# EAGLE design SparkFun_Micro_Bit_Moto_Bit (EAGLE 7.7.0)
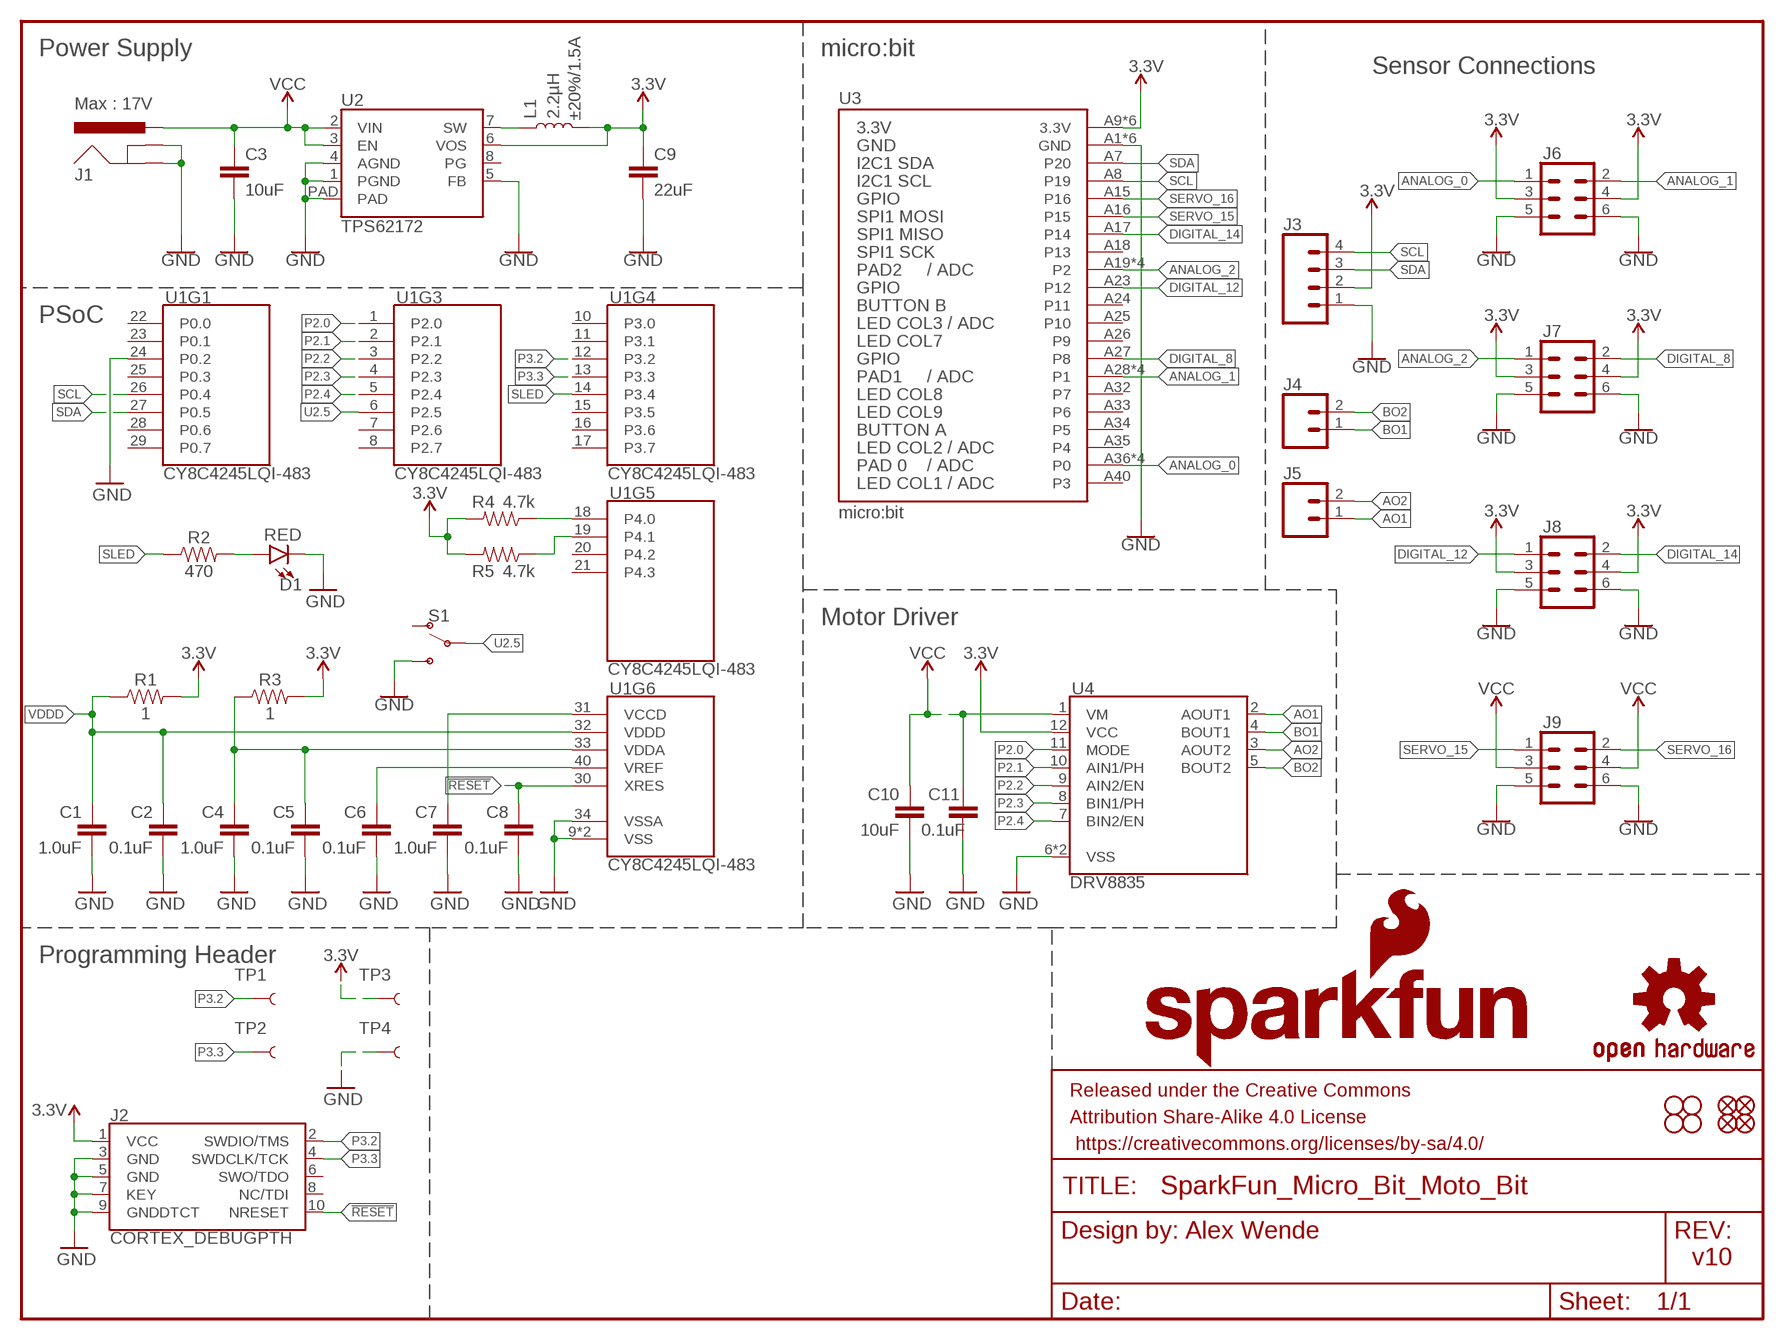
[diagram p0: schematic, sheet 1]

## Parts
C1  1.0uF  1.0UF-0603-16V-10%  [0603]
C2  0.1uF  0.1UF-0603-25V-(+80/-20%)  [0603]
C3  10uF  10UF-1210-50V-20%  [1210]
C4  1.0uF  1.0UF-0603-16V-10%  [0603]
C5  0.1uF  0.1UF-0603-25V-(+80/-20%)  [0603]
C6  0.1uF  0.1UF-0603-25V-(+80/-20%)  [0603]
C7  1.0uF  1.0UF-0603-16V-10%  [0603]
C8  0.1uF  0.1UF-0603-25V-(+80/-20%)  [0603]
C9  22uF  22UF-0805-6.3V-20%  [0805]
C10  10uF  10UF-1210-50V-20%  [1210]
C11  0.1uF  0.1UF-0603-25V-(+80/-20%)  [0603]
D1  RED  LED-RED0603  [LED-0603]
FD1  FIDUCIALUFIDUCIAL  [FIDUCIAL-MICRO]
FD2  FIDUCIALUFIDUCIAL  [FIDUCIAL-MICRO]
FD3  FIDUCIALUFIDUCIAL  [FIDUCIAL-MICRO]
FD4  FIDUCIALUFIDUCIAL  [FIDUCIAL-MICRO]
FRAME1  FRAME-LETTER  [CREATIVE_COMMONS]
H1  STAND-OFF  [STAND-OFF]
H2  STAND-OFF  [STAND-OFF]
H3  STAND-OFF  [STAND-OFF]
H4  STAND-OFF  [STAND-OFF]
J1  POWER_JACKPTH_LOCK  [POWER_JACK_PTH_LOCK]
J2  CORTEX_DEBUGPTH  [2X5-PTH-1.27MM]
J3  CONN_04SMD_STRAIGHT_COMBO  [1X04_SMD_VERTICAL_COMBO]
J4  CONN_02PTH_RA_FEMALE  [1X02_RA_FEMALE]
J5  CONN_02PTH_RA_FEMALE  [1X02_RA_FEMALE]
J6  CONN_03X2SMT  [2X3_SMT_POSTS]
J7  CONN_03X2SMT  [2X3_SMT_POSTS]
J8  CONN_03X2SMT  [2X3_SMT_POSTS]
J9  CONN_03X2SMT  [2X3_SMT_POSTS]
L1  2.2µH  INDUCTOR-VLF4012AT-2.2UH  [INDUCTOR_2.2UH]
LOGO1  SFE_LOGO_NAME_FLAME.3_INCH  [SFE_LOGO_NAME_FLAME_.3]
LOGO2  OSHW-LOGOL  [OSHW-LOGO-L]
R1  1  1OHM-0603-1/10W-1%  [0603]
R2  470  470OHM-0603-1/10W-1%  [0603]
R3  1  1OHM-0603-1/10W-1%  [0603]
R4  4.7k  4.7KOHM-0603-1/10W-1%  [0603]
R5  4.7k  4.7KOHM-0603-1/10W-1%  [0603]
S1  SWITCH-SPDT-PTH-11.6X4.0MM  [SWITCH_SPDT_PTH_11.6X4.0MM]
TP1  TEST-POINT3  [PAD.03X.03]
TP2  TEST-POINT3  [PAD.03X.03]
TP3  TEST-POINT3  [PAD.03X.03]
TP4  TEST-POINT3  [PAD.03X.03]
U1  CY8C4245LQI-483  PSOC4_4200_40QFN  [QFN-40]
U2  TPS62172  [WSON-8-PAD]
U3  micro:bit  MICRO:BITLEDS_UP  [MICRO:BIT_RA_PTH]
U4  DRV8835  DRV883X  [WSON-12]

## Nets
3.3V: C9.1 J2.1(VCC) J3.2 J6.3 J6.4 J7.3 J7.4 J8.3 J8.4 L1.P$2 R1.2 R3.2 R4.2 R5.2 TP3.P$1 U2.6(VOS) U3.A9(3.3V) U3.A10(3.3V) U3.A11(3.3V) U3.A12(3.3V) U3.A13(3.3V) U3.A14(3.3V) U4.12(VCC)
!RESET: C8.1 J2.10(NRESET) U1.30(XRES)
ANALOG_0: J6.1 U3.A36(P0) U3.A37(P0) U3.A38(P0) U3.A39(P0)
ANALOG_1: J6.2 U3.A28(P1) U3.A29(P1) U3.A30(P1) U3.A31(P1)
ANALOG_2: J7.1 U3.A19(P2) U3.A20(P2) U3.A21(P2) U3.A22(P2)
AO1: J5.1 U4.2(AOUT1)
AO2: J5.2 U4.3(AOUT2)
BO1: J4.1 U4.4(BOUT1)
BO2: J4.2 U4.5(BOUT2)
DIGITAL_8: J7.2 U3.A27(P8)
DIGITAL_12: J8.1 U3.A23(P12)
DIGITAL_14: J8.2 U3.A17(P14)
GND: C1.2 C2.2 C3.2 C4.2 C5.2 C6.2 C7.2 C8.2 C9.2 C10.2 C11.2 D1.C J1.GND J1.GNDBREAK J2.3(GND) J2.5(GND) J2.7(KEY) J2.9(GNDDTCT) J3.1 J6.5 J6.6 J7.5 J7.6 J8.5 J8.6 J9.5 J9.6 S1.3(S) TP4.P$1 U1.9(VSS) U1.24(P0.2) U1.34(VSSA) U1.EP(VSS) U2.1(PGND) U2.4(AGND) U2.5(FB) U2.PAD U3.A1(GND) U3.A2(GND) U3.A3(GND) U3.A4(GND) U3.A5(GND) U3.A6(GND) U4.6(VSS) U4.PAD(VSS)
N$1: C7.1 U1.31(VCCD)
N$2: C6.1 U1.40(VREF)
N$3: C4.1 C5.1 R3.1 U1.33(VDDA)
N$4: L1.P$1 U2.7(SW)
N$6: R4.1 U1.18(P4.0)
N$7: R5.1 U1.19(P4.1)
N$8: D1.A R2.2
P2.0: U1.1(P2.0) U4.11(MODE)
P2.1: U1.2(P2.1) U4.10(AIN1/PH)
P2.2: U1.3(P2.2) U4.9(AIN2/EN)
P2.3: U1.4(P2.3) U4.8(BIN1/PH)
P2.4: U1.5(P2.4) U4.7(BIN2/EN)
P3.2: J2.2(SWDIO/TMS) TP1.P$1 U1.12(P3.2)
P3.3: J2.4(SWDCLK/TCK) TP2.P$1 U1.13(P3.3)
SCL: J3.4 U1.26(P0.4) U3.A8(P19)
SDA: J3.3 U1.27(P0.5) U3.A7(P20)
SERVO_15: J9.1 U3.A16(P15)
SERVO_16: J9.2 U3.A15(P16)
SLED: R2.1 U1.14(P3.4)
U2.5: S1.2(P) U1.6(P2.5)
VCC: C3.1 C10.1 C11.1 J1.PWR J9.3 J9.4 U2.2(VIN) U2.3(EN) U4.1(VM)
VDDD: C1.1 C2.1 R1.1 U1.32(VDDD)
Unconnected: J2.6(SWO/TDO) J2.8(NC/TDI) S1.1(O) U1.7(P2.6) U1.8(P2.7) U1.10(P3.0) U1.11(P3.1) U1.15(P3.5) U1.16(P3.6) U1.17(P3.7) U1.20(P4.2) U1.21(P4.3) U1.22(P0.0) U1.23(P0.1) U1.25(P0.3) U1.28(P0.6) U1.29(P0.7) U1.35(P1.0) U1.36(P1.1) U1.37(P1.2) U1.38(P1.3) U1.39(P1.4) U2.8(PG) U3.A18(P13) U3.A24(P11) U3.A25(P10) U3.A26(P9) U3.A32(P7) U3.A33(P6) U3.A34(P5) U3.A35(P4) U3.A40(P3)

## Notes on the sheet
- Power Supply | micro:bit
- Sensor Connections
- Max : 17V
- ±20%/1.5A
- PSoC
- Motor Driver
- Programming Header
- Alex Wende
- v10

## Library data of the parts
C1 C4 C7 = SparkFun-Capacitors:1.0UF: 1µF ceramic capacitors A capacitor is a passive two-terminal electrical component used to store electrical energy temporarily in an electric field.; PROD_ID: CAP-00868
C2 C5 C6 C8 C11 = SparkFun-Capacitors:0.1UF: 0.1µF ceramic capacitors A capacitor is a passive two-terminal electrical component used to store electrical energy temporarily in an electric field.; PROD_ID: CAP-00810
C3 C10 = SparkFun-Capacitors:10UF: 10.0µF ceramic capacitors A capacitor is a passive two-terminal electrical component used to store electrical energy temporarily in an electric field.; PROD_ID: CAP-09824
C9 = SparkFun-Capacitors:22UF: 22µF ceramic capacitors A capacitor is a passive two-terminal electrical component used to store electrical energy temporarily in an electric field.; PROD_ID: CAP-08402
D1 = SparkFun-LED:LED-RED: Red SMD LED Used in manufacturing of most products at SparkFun Packages: 0603 - SMD 0603 package [Product Link] <http://docs.avagotech.com/docs/AV02-0551EN> 0603 SMART - SMD 0603 SMART package ( more efficient and expensive)[Product Link] <http://www.osram-os.com/Graphics/XPic2/00077099_0.pdf> 1206 - SMD1206 package [Product Link] <https://www.sparkfun.com/datasheets/DevTools/LilyPad/Q150OVS4.pdff> SparkFun Products: Pro Mini 328 -5V <https://www.sparkfun.com/products/821> RedBoard <https://www.sparkfun.com/products/12757> IOIO-OTG <https://www.sparkfun.com/products/13613>; PROD_ID: DIO-00819
FD1-FD4 = SparkFun-Aesthetics:FIDUCIAL: Fiducial Alignment Points Point-of-reference for pick-and-place machines and other optical instruments.
FRAME1 = SparkFun-Aesthetics:FRAME-LETTER: Schematic Frame - Letter Standard 8.5x11 US Letter frame
H1-H4 = SparkFun-Hardware:STAND-OFF: Stand Off Drill holes for mechanically mounting via screws, standoffs, etc. Note: Use the keepout ring to avoid running the screw head into surrounding components. Variant Overviews STAND-OFF - Mechanical footprint for a #4 phillips button head screw. STAND-OFF-TIGHT - Mechanical footprint for a #4 phillips button head screw, Example SparkFun Products Screw - Phillips Head (1/4", 4-40, 10 pack) <https://www.sparkfun.com/products/10453> (PRT-10453) Screw - Phillips Head (1/2", 4-40, 10 pack) <https://www.sparkfun.com/products/10452> (PRT-10452) Screw - Phillips Head (3/4", 4-40, 10 pack) <https://www.sparkfun.com/products/10451> (PRT-10451) Screw - Phillips Head (1", 4-40, 10 pack) <https://www.sparkfun.com/products/10450> (PRT-10450)
J1 = SparkFun-Connectors:POWER_JACK: Power Jack Connector This is the standard 5.5mm barrel jack for power. The PTH is the most common, proven, reliable, footprint. The Slot footprint only works if the mill layer is transmitted to the PCB fab house so be warned. Here are the connectors we sell at SparkFun: DC Barrel Power Jack/Connector <https://www.sparkfun.com/products/119> (PRT-00119) DC Barrel Power Jack/Connector (SMD) <https://www.sparkfun.com/products/12748> (PRT-12748) DC Barrel Jack Adapter - Breadboard Compatible <https://www.sparkfun.com/products/10811> (PRT-10811) It is used on this SparkFun product (and many, many others): SparkFun RedBoard - Programmed with Arduino <https://www.sparkfun.com/products/12757> (DEV-12757) Also, if you need a mating power supply or connector, please check these out: Wall Adapter Power Supply - 9VDC 650mA <https://www.sparkfun.com/products/298> (TOL-00298) DC Barrel Jack Adapter - Male <https://www.sparkfun.com/products/10287> (PRT-10287); PROD_ID: CONN-08197; SF_ID: PRT-00119
J2 = Pete_Connectors_Retired:CORTEX_DEBUG: Cortex Debug Connector Datasheet <http://infocenter.arm.com/help/topic/com.arm.doc.faqs/attached/13634/cortex_debug_connectors.pdf>
J3 = SparkFun-Connectors:CONN_04: Multi connection point. Often used as Generic Header-pin footprint for 0.1 inch spaced/style header connections On any of the 0.1 inch spaced packages, you can populate with these: Break Away Headers - Straight <https://www.sparkfun.com/products/116> (PRT-00116) Break Away Male Headers - Right Angle <https://www.sparkfun.com/products/553> (PRT-00553) Female Headers <https://www.sparkfun.com/products/115> (PRT-00115) Break Away Headers - Machine Pin <https://www.sparkfun.com/products/117> (PRT-00117) Break Away Female Headers - Swiss Machine Pin <https://www.sparkfun.com/products/743> (PRT-00743) For SCREWTERMINALS and SPRING TERMINALS visit here: Screw Terimnals on SparkFun.com <https://www.sparkfun.com/search/results?term=Screw+Terminals> (5mm/3.5mm/2.54mm spacing) This device is also useful as a general connection point to wire up your design to another part of your project. Our various solder wires solder well into these plated through hole pads. Hook-Up Wire - Assortment (Stranded, 22 AWG) <https://www.sparkfun.com/products/11375> (PRT-11375) Hook-Up Wire - Assortment (Solid Core, 22 AWG) <https://www.sparkfun.com/products/11367> (PRT-11367) View the entire wire category on our website here <https://www.sparkfun.com/categories/141> Special notes: Molex polarized connector foot print use with SKU : PRT-08231 with associated crimp pins and housings. 1MM SMD Version SKU: PRT-10208; PROD_ID: CONN-08511; VALUE: 1X04_SMD_STRAIGHT_COMBO
J4 J5 = SparkFun-Connectors:CONN_02: Multi connection point. Often used as Generic Header-pin footprint for 0.1 inch spaced/style header connections On any of the 0.1 inch spaced packages, you can populate with these: Break Away Headers - Straight <https://www.sparkfun.com/products/116> (PRT-00116) Break Away Male Headers - Right Angle <https://www.sparkfun.com/products/553> (PRT-00553) Female Headers <https://www.sparkfun.com/products/115> (PRT-00115) Break Away Headers - Machine Pin <https://www.sparkfun.com/products/117> (PRT-00117) Break Away Female Headers - Swiss Machine Pin <https://www.sparkfun.com/products/743> (PRT-00743) For SCREWTERMINALS and SPRING TERMINALS visit here: Screw Terimnals on SparkFun.com <https://www.sparkfun.com/search/results?term=Screw+Terminals> (5mm/3.5mm/2.54mm spacing) This device is also useful as a general connection point to wire up your design to another part of your project. Our various solder wires solder well into these plated through hole pads. Hook-Up Wire - Assortment (Stranded, 22 AWG) <https://www.sparkfun.com/products/11375> (PRT-11375) Hook-Up Wire - Assortment (Solid Core, 22 AWG) <https://www.sparkfun.com/products/11367> (PRT-11367) View the entire wire category on our website here <https://www.sparkfun.com/categories/141> Special notes: Molex polarized connector foot print use with: PRT-08233 with associated crimp pins and housings. 2.54_SCREWTERM for use with PRT-10571. 3.5mm Screw Terminal footprints for PRT-08084 5mm Screw Terminal footprints for use with PRT-08432; PROD_ID: CONN-13700
J6-J9 = SparkFun-Connectors:CONN_03X2: Multi connection point. Often used as Generic Header-pin footprint for 0.1 inch spaced/style header connections You can populate with any combo of single row headers, but if you'd like an exact match, check these: Header - 2x3 (Male, 0.1") <https://www.sparkfun.com/products/12807> (PRT-12807) Header - 2x3 (Female, 0.1") <https://www.sparkfun.com/products/13010> (PRT-13010) 2x3 Pin Shrouded Header <https://www.sparkfun.com/products/10877> (PRT-10877) On any of the 0.1 inch spaced packages, you can populate with these: Break Away Headers - Straight <https://www.sparkfun.com/products/116> (PRT-00116) Break Away Male Headers - Right Angle <https://www.sparkfun.com/products/553> (PRT-00553) Female Headers <https://www.sparkfun.com/products/115> (PRT-00115) Break Away Headers - Machine Pin <https://www.sparkfun.com/products/117> (PRT-00117) Break Away Female Headers - Swiss Machine Pin <https://www.sparkfun.com/products/743> (PRT-00743) Special note: the shrouded connector mates well with our 3x2 ribbon cables: Ribbon Crimp Connector - 6-pin (2x3, Female) <https://www.sparkfun.com/products/10651> (PRT-10651) Ribbon Cable - 6 wire (15ft) <https://www.sparkfun.com/products/10646> (PRT-10646); PROD_ID: CONN-11415
L1 = SparkFun-Coils:INDUCTOR: Inductors Resist changes in electrical current. Basically a coil of wire. SparkFun Products: SparkFun Load Cell Amplifier - HX711 <https://www.sparkfun.com/products/13879> IOIO-OTG - V2.2 <https://www.sparkfun.com/products/13613>; PROD_ID: NDUC-09513; VALUE: 2.2µH/±20%/1.5A
LOGO1 = SparkFun-Aesthetics:SFE_LOGO_NAME_FLAME: SparkFun Font Logo w/ Flame This is the SparkFun full logo. The logo on the schematic will always be the same size; the package variant is the height of the flame part of the logo. Default layer for the logo on the board is tSilk.
LOGO2 = SparkFun-Aesthetics:OSHW-LOGO: Open-Source Hardware (OSHW) Logo This logo indicates the piece of hardware it is found on incorporates a OSHW license and/or adheres to the definition of open source hardware found here: http://freedomdefined.org/OSHW
R1 R3 = SparkFun-Resistors:1OHM: 1Ω resistor A resistor is a passive two-terminal electrical component that implements electrical resistance as a circuit element. Resistors act to reduce current flow, and, at the same time, act to lower voltage levels within circuits. - Wikipedia; PROD_ID: RES-08269
R2 = SparkFun-Resistors:470OHM: 470Ω resistor A resistor is a passive two-terminal electrical component that implements electrical resistance as a circuit element. Resistors act to reduce current flow, and, at the same time, act to lower voltage levels within circuits. - Wikipedia; PROD_ID: RES-07869
R4 R5 = SparkFun-Resistors:4.7KOHM: 4.7kΩ resistor A resistor is a passive two-terminal electrical component that implements electrical resistance as a circuit element. Resistors act to reduce current flow, and, at the same time, act to lower voltage levels within circuits. - Wikipedia; PROD_ID: RES-07857
S1 = SparkFun-Switches:SWITCH-SPDT: Single Pole, Double Throw (SPDT) Switch Single-pole, double-throw (SPDT) switch. Variant Overview SMD-AYZ0202 Surface Mount DPDT Switch <https://www.sparkfun.com/products/597> (COM-00597) Used on e.g. LilyPad Arduino USB - ATmega32U4 Board <https://www.sparkfun.com/products/12049> PTH-11.6X4.0MM SPDT Mini Power Switch <https://www.sparkfun.com/products/102> (COM-00102) Used on e.g. SparkFun Simon Says - Through-Hole Soldering Kit <https://www.sparkfun.com/products/10547> (KIT-10547) PTH-11.6X4.0MM-KIT KIT version of SPDT Mini Power Switch - Simplifies soldering by removing tStop of switch pins - only one side can be soldered. PTH-11.6X4.0MM-LOCK LOCK version of SPDT Mini Power Switch - Offset pins hold switch in place for easier soldering. SMD-RIGHT-ANGLE Surface Mount Right Angle Switch <https://www.sparkfun.com/products/10860> (COM-10860) Used on e.g. SparkFun ESP8266 Thing <https://www.sparkfun.com/products/13231>; PROD_ID: SWCH-08261; SF_SKU: COM-00102
TP1-TP4 = SparkFun-Connectors:TEST-POINT: SparkFun Test Points Bare copper test points for troubleshooting or In-Circuit-Testing. These are used by our Production team for verifying production board runs using pogo-pins on test beds. SparkFun Products: SparkFun LSM9DS1 Breakout <https://www.sparkfun.com/products/13284> SparkFun PSOC <https://www.sparkfun.com/products/13714> SparkFun Load Cell Amplifier <https://www.sparkfun.com/products/13879>
U1 = SparkFun-IC-Microcontroller:PSOC4_4200_40QFN: Cypress PSoC 4200 32-bit MCU 48-MHz ARM Cortex-M0 Datasheet <http://www.cypress.com/file/138656/download> SparkFun Products: SparkFun serial Controlled Motor Driver <https://www.sparkfun.com/products/13911>; PROD_ID: IC-13292
U2 = SparkFun-IC-Power:TPS62172: Texas Instruments TPS62172 3-17V 0.5A Step-Down Converter with DCS control. Available in adjustable and fixed output voltage versions. Is packaged in an 8-pin WSON package measuring 2 × 2 mm (DSG). See a 3.3V fixed output version of this chip in action on the Electric Imp Breakout Board <https://www.sparkfun.com/products/11400>. Datasheet <http://www.ti.com/lit/gpn/tps62172>; PROD_ID: IC-11307
U3 = Micro_Bit_Parts:MICRO:BIT: BBC MICRO_BIT with 5x5 LED array facing the direction noted in the variant. "UP" means away from the host board, "Down" means facing towards the host board.; PROD_ID: CONN-13452
U4 = SparkFun-IC-Special-Function:DRV883X: DRV8835 2 Channel Motor Driver Dual 1.5A H-bridge, 2-11V Datasheet <http://www.ti.com/lit/ds/symlink/drv8835.pdf> SparkFun Products: SparkFun Serial Controlled Motor Driver <https://www.sparkfun.com/products/13911>; PROD_ID: IC-13342

## Board
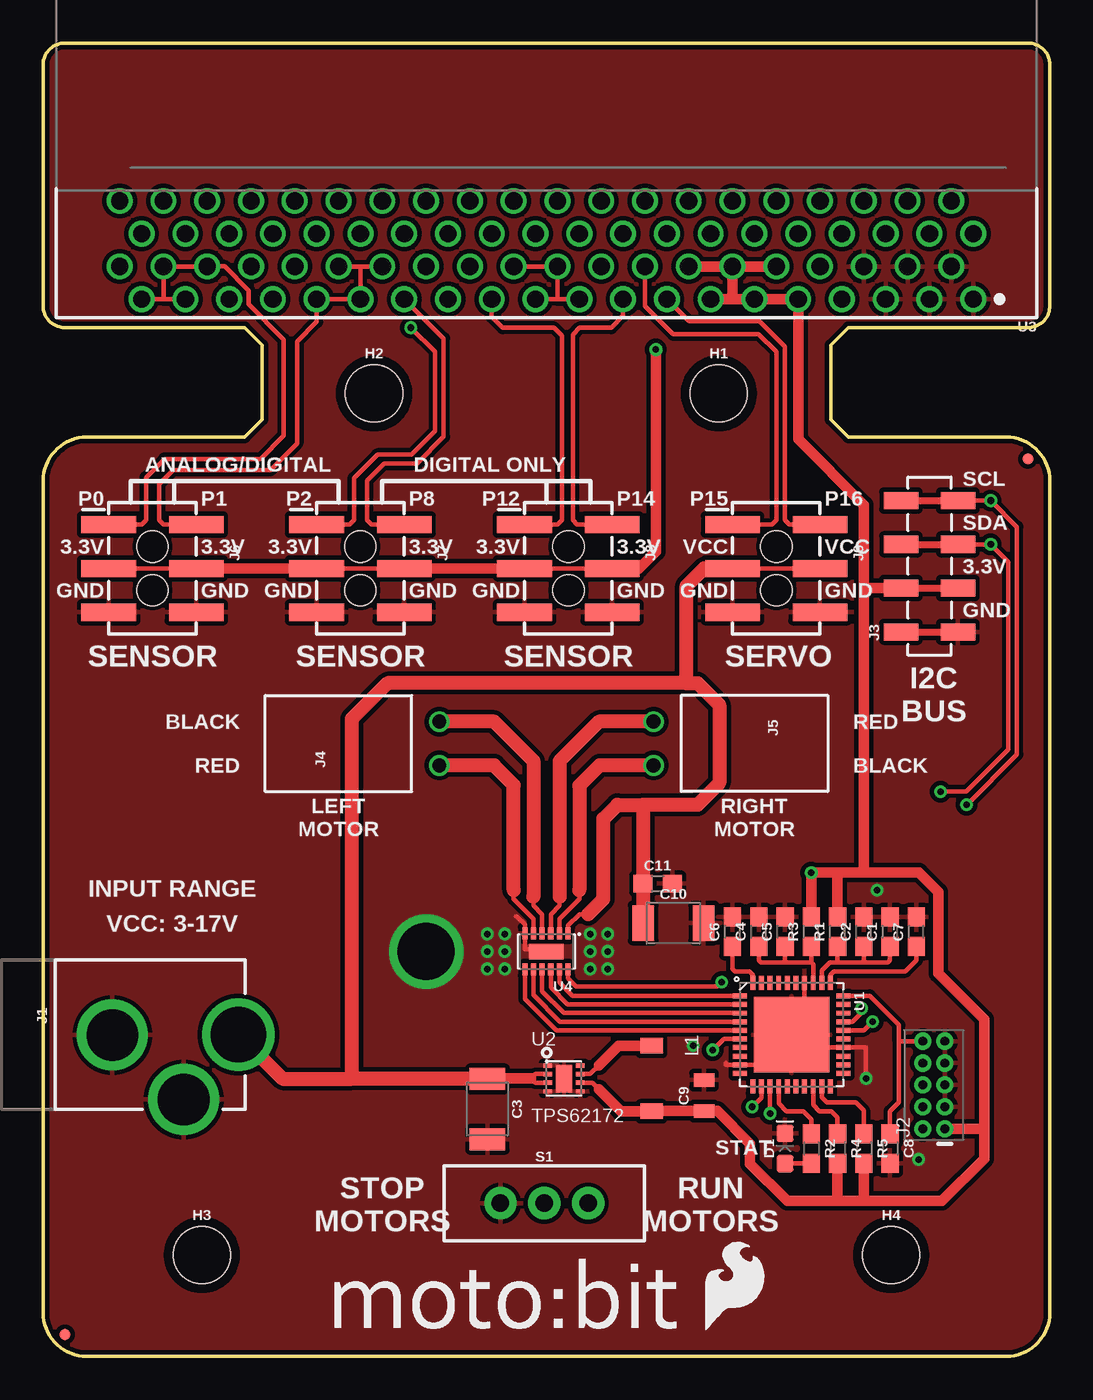
[diagram p1: board, top side]
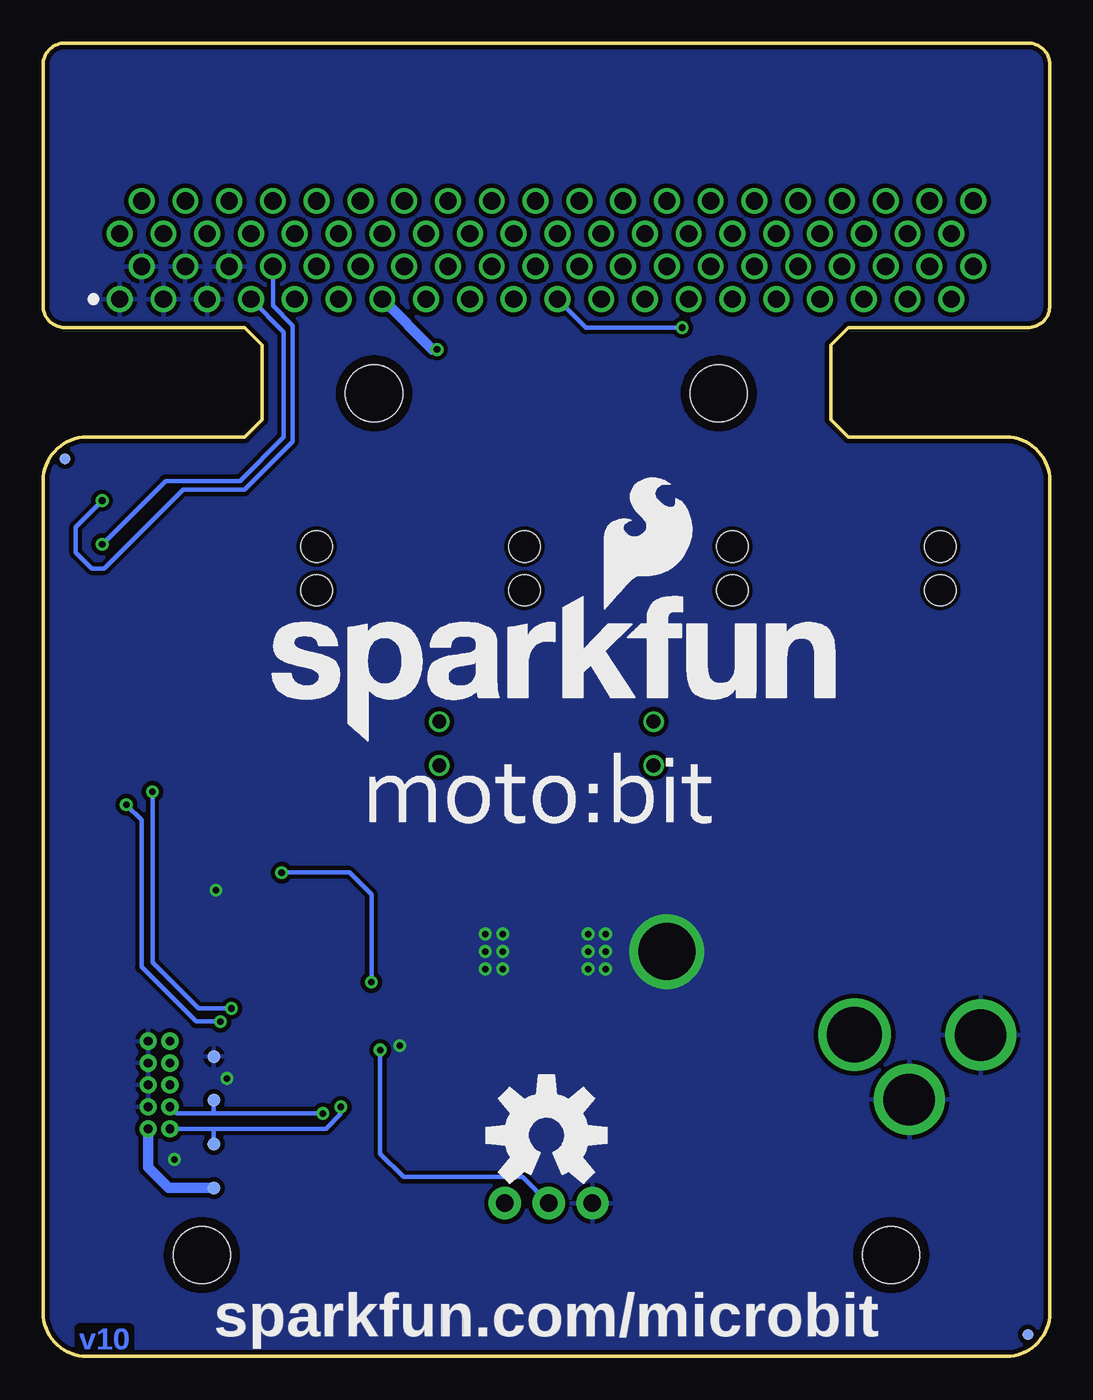
[diagram p2: board, bottom side, seen from below]

Size 58.42 x 76.2 mm. Coordinates in mm from the lower left corner, seen from the top.
Outline: 2.54,0 55.88,0 arc90 58.42,2.54 58.42,50.8 arc90 55.88,53.34 46.74,53.34 45.72,54.36 45.72,58.67 46.74,59.69 57.15,59.69 arc90 58.42,60.96 58.42,74.93 arc90 57.15,76.2 1.27,76.2 arc90 0,74.93 0,60.96 arc90 1.27,59.69 11.68,59.69 12.7,58.67 12.7,54.36 11.68,53.34 2.54,53.34 arc90 0,50.8 0,2.54 arc90 2.54,0
Copper layers (1*16): Top 0.035mm / dielectric 1.5mm / Bottom 0.035mm
Design rules "SparkFun-2-layer-TIGHT": minimum track width 7mil, minimum drill 15mil, track to track 7mil, track to pad 7mil, pad to pad 7mil, via to via 7mil, smd to smd 7mil, copper to edge 7mil, drill to drill 7mil, minimum pad ring 7mil, minimum via ring 7mil, stop-mask expansion 4mil, vias tented up to drill 25mil, thermal gap 10mil

### Footprints (pad centres in the part's own frame; a part is rotated, then mirrored left to right if it is on the bottom)
0603 = smd 1.1 x 1: 1 -0.85,0; 2 0.85,0
1210 = smd 1.27 x 2.06: 1 -1.755,0; 2 1.755,0
0805 = smd 0.8 x 1.2: 1 -0.9,0; 2 0.9,0
LED-0603 = smd 1 x 1: A -0.877,0; C 0.877,0
FIDUCIAL-MICRO = smd 0.635 x 0.635: 1 0,0
STAND-OFF = hole 3.302: 0,0
POWER_JACK_PTH_LOCK = drill 2.997 pad 4.115: GND 0.025,6.557; GNDBREAK 3.762,10.7 | drill 3.2 pad 4.115: PWR 0,13.878
2X5-PTH-1.27MM = drill 0.508 pad 1: 1 -2.54,-0.635; 2 -2.54,0.635; 3 -1.27,-0.635; 4 -1.27,0.635; 5 0,-0.635; 6 0,0.635; 7 1.27,-0.635; 8 1.27,0.635; 9 2.54,-0.635; 10 2.54,0.635
1X04_SMD_VERTICAL_COMBO = smd 1 x 2: 1 0,-1.65; 1-2 0,1.65; 2 2.54,1.65; 2-2 2.54,-1.65; 3 5.08,-1.65; 3-2 5.08,1.65; 4 7.62,1.65; 4-2 7.62,-1.65
1X02_RA_FEMALE = drill 0.8: 1 1.27,-5.85; 2 -1.27,-5.85
2X3_SMT_POSTS = smd 1 x 3.17: 1 -2.54,-2.54; 2 -2.54,2.54; 3 0,-2.54; 4 0,2.54; 5 2.54,-2.54; 6 2.54,2.54 | hole 1.8: -1.27,0; 1.27,0
INDUCTOR_2.2UH = smd 0.9 x 1.3: P$1 -1.9,0; P$2 1.9,0
SWITCH_SPDT_PTH_11.6X4.0MM = drill 1.016 pad 1.88: 1 0,2.54; 2 0,0; 3 0,-2.54
PAD.03X.03 = smd 0.762 x 0.762: P$1 0,0
QFN-40 = smd 0.285 x 0.8: 1 -2.25,-3; 2 -1.75,-3; 3 -1.25,-3; 4 -0.75,-3; 5 -0.25,-3; 6 0.25,-3; 7 0.75,-3; 8 1.25,-3; 9 1.75,-3; 10 2.25,-3; 21 2.25,3; 22 1.75,3; 23 1.25,3; 24 0.75,3; 25 0.25,3; 26 -0.25,3; 27 -0.75,3; 28 -1.25,3; 29 -1.75,3; 30 -2.25,3 | smd 0.8 x 0.285: 11 3,-2.25; 12 3,-1.75; 13 3,-1.25; 14 3,-0.75; 15 3,-0.25; 16 3,0.25; 17 3,0.75; 18 3,1.25; 19 3,1.75; 20 3,2.25; 31 -3,2.25; 32 -3,1.75; 33 -3,1.25; 34 -3,0.75; 35 -3,0.25; 36 -3,-0.25; 37 -3,-0.75; 38 -3,-1.25; 39 -3,-1.75; 40 -3,-2.25 | smd 4.4 x 4.4: EP 0,0
WSON-8-PAD = smd 0.25 x 0.5: 1 -0.75,-0.95; 2 -0.25,-0.95; 3 0.25,-0.95; 4 0.75,-0.95; 5 0.75,0.95; 6 0.25,0.95; 7 -0.25,0.95; 8 -0.75,0.95 | smd 1.6 x 0.9: PAD 0,0
MICRO:BIT_RA_PTH = drill 1: A1 -24.765,7.62; A2 -23.495,5.72; A3 -22.225,7.62; A4 -20.955,5.72; A5 -19.685,7.62; A6 -18.415,5.72; A7 -17.145,7.62; A8 -15.875,5.72; A9 -14.605,7.62; A10 -13.335,5.72; A11 -12.065,7.62; A12 -10.795,5.72; A13 -9.525,7.62; A14 -8.255,5.72; A15 -6.985,7.62; A16 -5.715,5.72; A17 -4.445,7.62; A18 -3.175,5.72; A19 -1.905,7.62; A20 -0.635,5.72; A21 0.635,7.62; A22 1.905,5.72; A23 3.175,7.62; A24 4.445,5.72; A25 5.715,7.62; A26 6.985,5.72; A27 8.255,7.62; A28 9.525,5.72; A29 10.795,7.62; A30 12.065,5.72; A31 13.335,7.62; A32 14.605,5.72; A33 15.875,7.62; A34 17.145,5.72; A35 18.415,7.62; A36 19.685,5.72; A37 20.955,7.62; A38 22.225,5.72; A39 23.495,7.62; A40 24.765,5.72; B1 -24.765,3.82; B2 -23.495,1.92; B3 -22.225,3.82; B4 -20.955,1.92; B5 -19.685,3.82; B6 -18.415,1.92; B7 -17.145,3.82; B8 -15.875,1.92; B9 -14.605,3.82; B10 -13.335,1.92; B11 -12.065,3.82; B12 -10.795,1.92; B13 -9.525,3.82; B14 -8.255,1.92; B15 -6.985,3.82; B16 -5.715,1.92; B17 -4.445,3.82; B18 -3.175,1.92; B19 -1.905,3.82; B20 -0.635,1.92; B21 0.635,3.82; B22 1.905,1.92; B23 3.175,3.82; B24 4.445,1.92; B25 5.715,3.82; B26 6.985,1.92; B27 8.255,3.82; B28 9.525,1.92; B29 10.795,3.82; B30 12.065,1.92; B31 13.335,3.82; B32 14.605,1.92; B33 15.875,3.82; B34 17.145,1.92; B35 18.415,3.82; B36 19.685,1.92; B37 20.955,3.82; B38 22.225,1.92; B39 23.495,3.82; B40 24.765,1.92
WSON-12 = smd 0.3 x 0.7: 1 -1.25,-1.05; 2 -0.75,-1.05; 3 -0.25,-1.05; 4 0.25,-1.05; 5 0.75,-1.05; 6 1.25,-1.05; 7 1.25,1.05; 8 0.75,1.05; 9 0.25,1.05; 10 -0.25,1.05; 11 -0.75,1.05; 12 -1.25,1.05 | smd 2 x 0.9: PAD 0,0

### Placement (x,y rotation side)
C1  49.15,24.64 90 top
C2  47.62,24.64 90 top
C3  25.78,14.35 270 top
C4  41.53,24.64 90 top
C5  43.05,24.64 90 top
C6  40.01,24.64 90 top
C7  50.67,24.64 90 top
C8  49.15,12.06 270 top
C9  38.35,15.13 90 top
C10  36.58,25.15 0 top
C11  35.66,27.43 0 top
D1  43.05,12.06 90 top
FD1  1.27,1.27 0 top
FD2  57.15,52.07 0 top
FD3  1.27,1.27 0 bottom
FD4  57.15,52.07 0 bottom
FRAME1  -6.35,-31.75 0 top  (outside the outline)
H1  39.21,55.88 0 top
H2  19.21,55.88 0 top
H3  9.21,5.88 0 top
H4  49.21,5.88 0 top
J1  -2.54,18.67 270 top
J2  51.69,15.75 90 top
J3  51.44,42.04 90 top
J4  17.14,35.56 90 top
J5  41.27,35.56 270 top
J6  6.35,45.72 270 top
J7  18.41,45.72 270 top
J8  30.48,45.72 270 top
J9  42.55,45.72 270 top
L1  35.31,16.13 270 top
LOGO1  45.72,35.56 0 bottom
LOGO2  29.21,12.83 0 bottom
R1  46.1,24.64 90 top
R2  44.58,12.06 270 top
R3  44.58,24.64 90 top
R4  46.1,12.06 270 top
R5  47.62,12.06 270 top
S1  29.08,8.89 270 top
TP1  48.51,12.32 270 bottom
TP2  48.51,14.86 270 bottom
TP3  48.51,9.78 270 bottom
TP4  48.51,17.4 270 bottom
U1  43.43,18.67 270 top
U2  30.23,16.13 270 top
U3  29.21,68.96 180 top
U4  29.21,23.5 180 top
U$1  [PRODUCTION_INSTRUCTIONS]  -20.32,-36.83 0 top  (outside the outline)
U$2  [SFE_LOGO_FLAME_.2]  38.1,1.27 0 top
U$3  [LOGO-MOTOBIT]  16.76,1.27 0 top
U$4  [LOGO-MOTOBIT]  39.62,30.61 0 bottom

### Tracks (layer width: path | path; a pad name or v marks a point on that pad's centre or on a via)
3.3V  (via drill 0.38)
  Top 0.254: 32.26,15.49 31.87,15.88 U2.6 | U4.12 30.46,21.94 30.93,21.46 39.12,21.46 v39.37,21.72 | J8.3 J8.4 | J7.3 J7.4 | J6.3 J6.4
  Top 0.61: U3.A14 U3.A12 | U3.A12 U3.A10 | 40.01,61.34 U3.A11 U3.A9 43.81,53.22 47.62,49.41 47.62,44.58 | J6.4 J7.3 | J7.4 J8.3 | J3.2 47.62,44.58 | 32.26,15.49 33.52,14.23 L1.P$2 C9.1 39.12,14.23 41.02,12.34 41.02,11.19 43.18,9.02 46.1,9.02 | U3.A12 40.01,61.34 | 40.01,61.34 U3.A13 | 47.62,28.07 50.81,28.07 51.94,26.94 51.94,22.23 54.61,19.56 54.61,13.21 | 47.62,28.07 46.1,28.07 | 46.1,28.07 R1.2 | R3.2 v44.58,28.07 46.1,28.07 | 47.62,44.58 47.62,28.07 | v35.56,58.42 35.56,46.71 34.57,45.72 J8.4 | 54.61,13.21 54.61,11.47 52.16,9.02 47.62,9.02 | J2.1 54.61,13.21 | R5.2 47.62,9.02 | R4.2 46.1,9.02 | 46.1,9.02 47.62,9.02
  Bottom 0.254: v39.37,21.72 39.37,26.79 40.65,28.07 v44.58,28.07
  Bottom 0.61: TP3.P$1 51.13,9.78 52.32,10.98 J2.1 | v35.56,58.42 35.81,58.42 U3.A13
!RESET
  Top 0.203: U1.30 46.43,20.9
  Top 0.254: U1.30 47.97,20.92 49.66,19.23 49.66,18.29 | 49.66,18.29 49.66,14.73 49.15,14.22 C8.1 | J2.10 49.66,18.29
ANALOG_0
  Top 0.254: 6.99,61.34 U3.A37 | J6.1 5.71,48.26 5.97,48.51 5.97,50.99 7.05,52.07 12.62,52.07 13.97,53.42 13.97,59.01 11.94,61.04 11.94,61.85 10.54,63.25 U3.A36 U3.A38 6.99,61.34 | 6.99,61.34 U3.A39
ANALOG_1
  Top 0.254: 18.41,63.24 U3.A28 18.1,63.24 | J6.2 6.99,48.26 6.73,48.51 6.73,50.62 7.54,51.44 13.2,51.44 14.73,52.96 14.73,58.89 15.88,60.03 U3.A31 U3.A29 18.41,63.24 | 18.41,63.24 U3.A30
ANALOG_2  (via drill 0.38)
  Top 0.254: U3.A22 U3.A20 29.84,61.34 | 29.84,61.34 U3.A19 | 29.84,61.34 U3.A21 | J7.1 17.78,48.26 18.03,48.51 18.03,50.95 19.41,52.32 21.38,52.32 22.73,53.67 22.73,58.29 v21.34,59.69
  Bottom 0.254: v21.34,59.69 26.92,59.69 U3.A21
AO1
  Top 0.254: U4.2 29.96,25.39 31.11,26.54 31.11,27.05
  Top 0.813: 31.11,27.05 31.11,33.12 32.29,34.29 J5.1
AO2
  Top 0.254: U4.3 29.46,25.65 29.97,26.16 29.97,26.67
  Top 0.813: 29.97,26.67 29.97,34.54 32.26,36.83 J5.2
BO1
  Top 0.254: U4.4 28.96,25.65 28.45,26.16 28.45,26.67
  Top 0.813: 28.45,26.67 28.45,34.56 26.18,36.83 J4.1
BO2
  Top 0.254: U4.5 28.46,25.39 27.3,26.54 27.3,27.05
  Top 0.813: 27.3,27.05 27.3,33.15 26.17,34.29 J4.2
DIGITAL_8
  Top 0.254: J7.2 19.05,48.26 18.8,48.51 18.8,50.82 19.79,51.82 21.69,51.82 23.24,53.37 23.24,59.05 U3.A27
DIGITAL_12
  Top 0.254: J8.1 29.84,48.26 30.1,48.51 30.1,59.23 29.64,59.69 26.67,59.69 26.04,60.33 U3.A23
DIGITAL_14
  Top 0.254: J8.2 30.99,48.26 30.73,48.51 30.73,59.29 31.14,59.69 32.97,59.69 33.66,60.37 U3.A17
GND  (via drill 0.38, 3.3)
  Top 0.254: U1.34 44.18,19.42 U1.EP 41.68,16.92 U1.9 39.62,16.92 39.62,17.02 | 28.96,23.62 27.96,23.62 U4.6 27.96,25.05 27.48,25.53 27.43,25.53 | v47.75,16.13 47.75,17.92 U1.24 43.18,17.92 43.18,19.05
  other vias: 31.75,23.5 31.75,24.51 31.75,22.48 32.77,24.51 32.77,23.5 32.77,22.48 25.78,23.5 25.78,24.51 25.78,22.48 26.8,24.51 26.8,23.5 26.8,22.48 48.39,27.05 50.8,11.43 37.72,18.03 22.23,23.5
  pour Top (isolate 0.254, rank 2): 0,60.96 0,74.93 arc-90 1.27,76.2 57.15,76.2 arc-90 58.42,74.93 58.42,60.96 arc-90 57.15,59.69 46.74,59.69 45.72,58.67 45.72,54.36 46.74,53.34 55.88,53.34 arc-90 58.42,50.8 58.42,2.54 arc-90 55.88,0 2.54,0 arc-90 0,2.54 0,50.8 arc-90 2.54,53.34 11.68,53.34 12.7,54.36 12.7,58.67 11.68,59.69 1.27,59.69 arc-90
  pour Bottom (isolate 0.254, rank 2): 46.74,53.34 55.88,53.34 arc-90 58.42,50.8 58.42,2.54 arc-90 55.88,0 2.54,0 arc-90 0,2.54 0,50.8 arc-90 2.54,53.34 11.68,53.34 12.7,54.36 12.7,58.67 11.68,59.69 1.27,59.69 arc-90 0,60.96 0,74.93 arc-90 1.27,76.2 57.15,76.2 arc-90 58.42,74.93 58.42,60.96 arc-90 57.15,59.69 46.74,59.69 45.72,58.67 45.72,54.36
N$1
  Top 0.254: U1.31 45.68,22.14 45.89,22.35 50.04,22.35 50.67,22.99 C7.1
N$2
  Top 0.254: C6.1 40.01,22.48 40.13,22.35 40.98,22.35 41.18,22.14 U1.40
N$3
  Top 0.254: 44.58,22.86 43.05,22.86 | 43.05,22.86 41.66,22.86 41.53,22.99 C4.1 | C5.1 43.05,22.86 | R3.1 44.58,22.86 | 44.58,22.86 44.68,22.75 U1.33
N$4
  Top 0.254: U2.7 31.75,16.38 32.26,16.89
  Top 0.61: 32.26,16.89 33.4,18.03 L1.P$1
N$6
  Top 0.254: U1.18 44.68,14.6 45.06,14.22 45.74,14.22 46.1,13.87 R4.1
N$7
  Top 0.254: U1.19 45.18,15.04 45.49,14.73 47.17,14.73 47.62,14.27 R5.1
N$8
  Top 0.254: D1.A 43.05,11.21 R2.2
P2.0
  Top 0.203: U1.1
  Top 0.254: 29.94,22.45 U4.11 29.96,21.69 30.73,20.92 U1.1
P2.1
  Top 0.203: U1.2
  Top 0.254: 29.44,22.45 U4.10 29.46,21.4 30.44,20.42 U1.2
P2.2
  Top 0.203: U1.3
  Top 0.254: 28.94,22.45 U4.9 28.96,21.17 30.21,19.92 U1.3
P2.3
  Top 0.203: U1.4
  Top 0.254: 28.44,22.45 U4.8 28.46,20.97 30.01,19.42 U1.4
P2.4
  Top 0.203: U1.5
  Top 0.254: 27.94,22.45 U4.7 27.96,20.74 29.78,18.92 U1.5
P3.2  (via drill 0.38)
  Top 0.254: v41.15,14.48 41.68,15.01 U1.12
  Bottom 0.254: v41.15,14.48 41.15,14.06 42,13.21 48.51,13.21 | 48.51,13.21 J2.2 | TP1.P$1 48.51,13.21
P3.3  (via drill 0.38)
  Top 0.254: v42.18,14.1 U1.13
  Bottom 0.254: v42.18,14.1 48.51,14.1 | 48.51,14.1 50.67,14.1 J2.4 | TP2.P$1 48.51,14.1
SCL  (via drill 0.38)
  Top 0.254: J3.4 v54.99,49.66 56.52,48.13 56.52,34.92 v53.59,32 | U1.26 47.62,18.92 v48.13,19.43
  Bottom 0.254: U3.A8 45.09,60.96 43.94,59.82 43.94,53.09 46.74,50.29 50.29,50.29 54.86,45.72 55.6,45.72 56.52,46.64 56.52,48.13 v54.99,49.66 | v48.13,19.43 49.55,19.43 52.7,22.59 52.7,31.11 v53.59,32
SDA  (via drill 0.38)
  Top 0.254: J3.3 v54.99,47.12 56.01,46.1 56.01,35.21 53.57,32.77 v52.07,32.77 | U1.27 46.95,19.42 47.5,19.97 v47.5,20.19
  Bottom 0.254: v52.07,32.77 52.07,22.86 49.4,20.19 v47.5,20.19 | U3.A7 44.45,59.44 44.45,53.34 46.99,50.8 51.31,50.8 v54.99,47.12
SERVO_15
  Top 0.254: J9.1 42.29,48.26 42.55,48.51 42.55,58.28 41.52,59.31 36.55,59.31 34.92,60.94 U3.A16
SERVO_16
  Top 0.254: J9.2 43.31,48.26 43.05,48.51 43.05,58.59 41.57,60.07 37.47,60.07 U3.A15
SLED
  Top 0.254: R2.1 44.58,13.77 44.12,14.22 43.13,14.22 42.68,14.67 U1.14
U2.5  (via drill 0.38)
  Top 0.254: U1.6 39.5,18.42 v38.86,17.78
  Bottom 0.254: v38.86,17.78 38.86,11.76 37.51,10.41 30.61,10.41 S1.2
VCC
  Top 0.254: U2.2 28.57,16.38 28.32,16.13 28.57,15.88 U2.3 | 31.62,25.65 31.11,25.65 30.46,25 U4.1 | J9.3 J9.4
  Top 0.61: C3.1 25.8,16.13 28.32,16.13
  Top 0.813: 31.62,25.65 32.51,26.54 32.51,31.19 33.33,32 34.81,32 | 37.34,39.07 37.34,44.7 38.35,45.72 J9.3 | 37.34,39.07 19.99,39.07 17.91,36.99 17.91,16.11 | 34.81,32 C11.1 C10.1 | 37.34,39.07 37.97,39.07 39.24,37.8 39.24,33.27 37.97,32 34.81,32 | C3.1 17.91,16.11 | J1.PWR 13.9,16.11 17.91,16.11
VDDD
  Top 0.254: U1.32 45.18,22.39 45.66,22.86 46.1,22.86 | 46.1,22.86 R1.1 | C1.1 49.15,22.99 49.02,22.86 47.62,22.86 | 47.62,22.86 46.1,22.86 | C2.1 47.62,22.86

### Text on the board
Bottom: v10
tPlace: ANALOG/DIGITAL | DIGITAL ONLY | SCL | P0 | P1 | P2 | P8 | P12 | P14 | P15 | P16 | SDA | 3.3V | 3.3V | 3.3V | 3.3V | 3.3V | 3.3V | VCC | VCC | 3.3V | GND | GND | GND | GND | GND | GND | GND | GND | GND | SENSOR | SENSOR | SENSOR | SERVO | I2C / BUS | BLACK | RED | RED | BLACK | LEFT / MOTOR | RIGHT / MOTOR | INPUT RANGE | VCC: 3-17V | STAT | STOP / MOTORS | RUN / MOTORS
bPlace: sparkfun.com/microbit
Measures: Units are in Inches
tDocu: Alex Wende | - Solder mask color : Gloss Black